# EAGLE board CFT-PB2-smd-revB-old (EAGLE 5.11), part 1 of 2
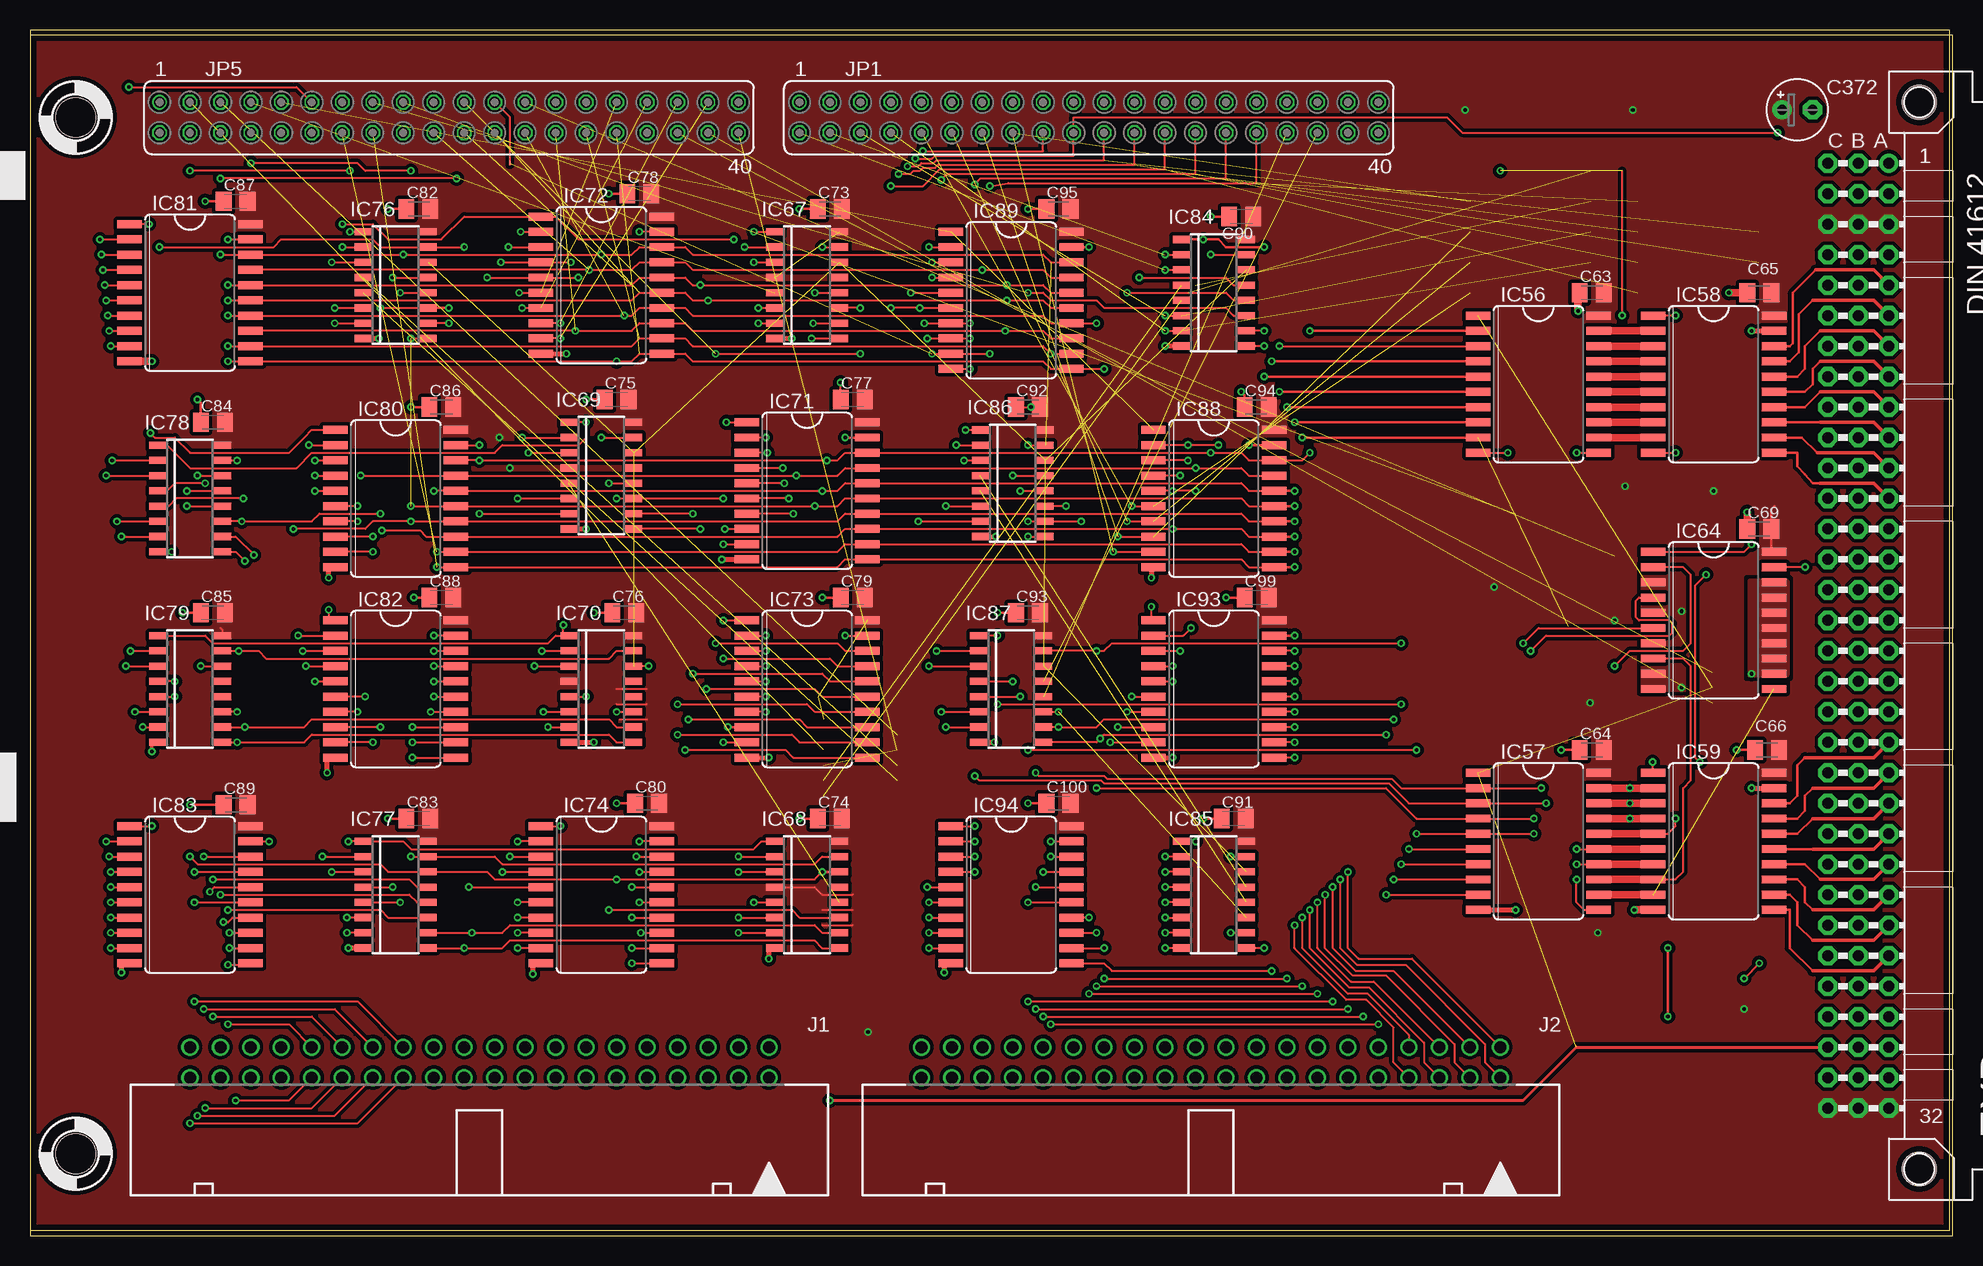
[diagram p6: board, top side]
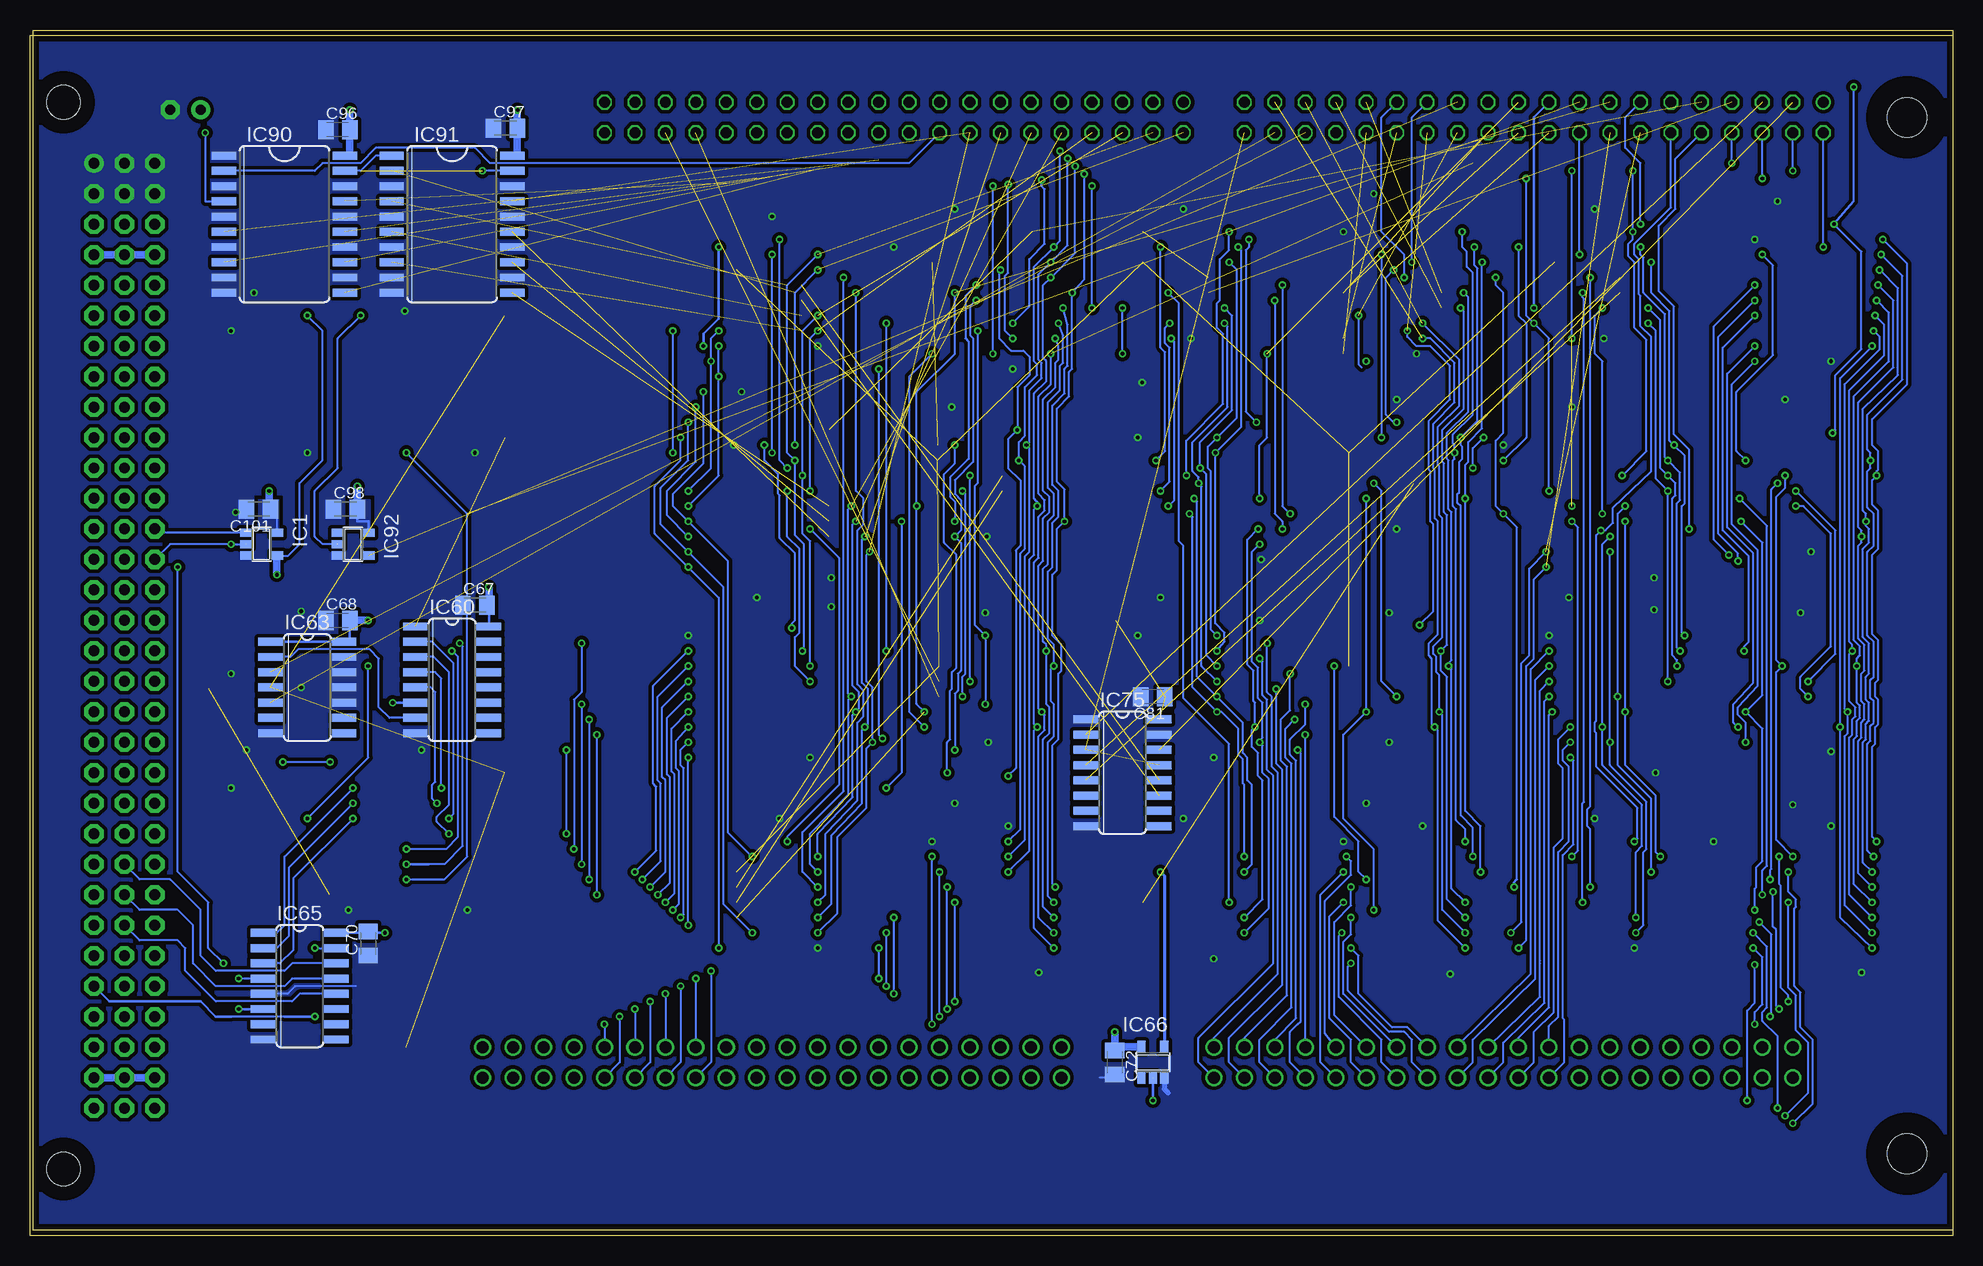
[diagram p7: board, bottom side, seen from below]

Size 160 x 100 mm. Coordinates in mm from the lower left corner, seen from the top.
Outline: 0,0 160,0 160,100 0,100 0,0
Copper layers (1*16): Top 0.035mm / dielectric 0.2mm / Bottom 0.035mm
Design rules "MyroPCB-6mil-prototyping": minimum track width 6mil, minimum drill 12mil, track to track 6mil, track to pad 6mil, pad to pad 6mil, via to via 6mil, smd to smd 6mil, copper to edge 20mil, drill to drill 8mil, minimum pad ring 6mil, minimum via ring 6mil, stop-mask expansion 4mil, vias tented up to drill 0mil, thermal gap 6mil
Net classes: 0 default: width 0.152 mm, clearance 0.152 mm; 1 low power: width 0.305 mm, clearance 0.152 mm; 2 LED power: width 0.406 mm, clearance 0.254 mm

## Footprints (pad centres in the part's own frame; a part is rotated, then mirrored left to right if it is on the bottom)
C0805K = smd 1.3 x 1.6: 1 -1,0; 2 1,0
E2,5-5 = drill 0.813 pad 1.6 round: + -1.27,0 | drill 0.813 pad 1.6 octagon: - 1.27,0
VG96K = drill 0.914 pad 1.6 round: A1 154.94,39.37 | drill 0.914 pad 1.6 octagon: A2 154.94,36.83; A3 154.94,34.29; A4 154.94,31.75; A5 154.94,29.21; A6 154.94,26.67; A7 154.94,24.13; A8 154.94,21.59; A9 154.94,19.05; A10 154.94,16.51; A11 154.94,13.97; A12 154.94,11.43; A13 154.94,8.89; A14 154.94,6.35; A15 154.94,3.81; A16 154.94,1.27; A17 154.94,-1.27; A18 154.94,-3.81; A19 154.94,-6.35; A20 154.94,-8.89; A21 154.94,-11.43; A22 154.94,-13.97; A23 154.94,-16.51; A24 154.94,-19.05; A25 154.94,-21.59; A26 154.94,-24.13; A27 154.94,-26.67; A28 154.94,-29.21; A29 154.94,-31.75; A30 154.94,-34.29; A31 154.94,-36.83; A32 154.94,-39.37; B1 152.4,39.37; B2 152.4,36.83; B3 152.4,34.29; B4 152.4,31.75; B5 152.4,29.21; B6 152.4,26.67; B7 152.4,24.13; B8 152.4,21.59; B9 152.4,19.05; B10 152.4,16.51; B11 152.4,13.97; B12 152.4,11.43; B13 152.4,8.89; B14 152.4,6.35; B15 152.4,3.81; B16 152.4,1.27; B17 152.4,-1.27; B18 152.4,-3.81; B19 152.4,-6.35; B20 152.4,-8.89; B21 152.4,-11.43; B22 152.4,-13.97; B23 152.4,-16.51; B24 152.4,-19.05; B25 152.4,-21.59; B26 152.4,-24.13; B27 152.4,-26.67; B28 152.4,-29.21; B29 152.4,-31.75; B30 152.4,-34.29; B31 152.4,-36.83; B32 152.4,-39.37; C1 149.86,39.37; C2 149.86,36.83; C3 149.86,34.29; C4 149.86,31.75; C5 149.86,29.21; C6 149.86,26.67; C7 149.86,24.13; C8 149.86,21.59; C9 149.86,19.05; C10 149.86,16.51; C11 149.86,13.97; C12 149.86,11.43; C13 149.86,8.89; C14 149.86,6.35; C15 149.86,3.81; C16 149.86,1.27; C17 149.86,-1.27; C18 149.86,-3.81; C19 149.86,-6.35; C20 149.86,-8.89; C21 149.86,-11.43; C22 149.86,-13.97; C23 149.86,-16.51; C24 149.86,-19.05; C25 149.86,-21.59; C26 149.86,-24.13; C27 149.86,-26.67; C28 149.86,-29.21; C29 149.86,-31.75; C30 149.86,-34.29; C31 149.86,-36.83; C32 149.86,-39.37 | hole 2.794: 157.48,44.45; 157.48,-44.45
STANDOFF_28_60 = hole 3.302: 0,0
SOT23-5 = smd 0.69 x 0.99: 1 -0.95,-1.29; 2 0,-1.29; 3 0.95,-1.29; 4 0.95,1.3; 5 -0.95,1.3
SO20W = smd 0.66 x 2.032: 1 -5.715,-5.029; 2 -4.445,-5.029; 3 -3.175,-5.029; 4 -1.905,-5.029; 5 -0.635,-5.029; 6 0.635,-5.029; 7 1.905,-5.029; 8 3.175,-5.029; 9 4.445,-5.029; 10 5.715,-5.029; 11 5.715,5.029; 12 4.445,5.029; 13 3.175,5.029; 14 1.905,5.029; 15 0.635,5.029; 16 -0.635,5.029; 17 -1.905,5.029; 18 -3.175,5.029; 19 -4.445,5.029; 20 -5.715,5.029
SO16 = smd 0.66 x 2.032: 1 -4.445,-3.073; 2 -3.175,-3.073; 3 -1.905,-3.073; 4 -0.635,-3.073; 5 0.635,-3.073; 6 1.905,-3.073; 7 3.175,-3.073; 8 4.445,-3.073; 9 4.445,3.073; 10 3.175,3.073; 11 1.905,3.073; 12 0.635,3.073; 13 -0.635,3.073; 14 -1.905,3.073; 15 -3.175,3.073; 16 -4.445,3.073
SO14 = smd 0.66 x 2.032: 1 -3.81,-3.073; 2 -2.54,-3.073; 3 -1.27,-3.073; 4 0,-3.073; 5 1.27,-3.073; 6 2.54,-3.073; 7 3.81,-3.073; 8 3.81,3.073; 9 2.54,3.073; 10 1.27,3.073; 11 0,3.073; 12 -1.27,3.073; 13 -2.54,3.073; 14 -3.81,3.073
SO16D = smd 0.6 x 1.4: 1 -4.445,-2.715; 2 -3.175,-2.715; 3 -1.905,-2.715; 4 -0.635,-2.715; 5 0.635,-2.715; 6 1.905,-2.715; 7 3.175,-2.715; 8 4.445,-2.715; 9 4.445,2.715; 10 3.175,2.715; 11 1.905,2.715; 12 0.635,2.715; 13 -0.635,2.715; 14 -1.905,2.715; 15 -3.175,2.715; 16 -4.445,2.715
PAK100/2500-5-40 = drill 1 pad 1.422 round: 1 -24.13,-1.27; 2 -24.13,1.27; 3 -21.59,-1.27; 4 -21.59,1.27; 5 -19.05,-1.27; 6 -19.05,1.27; 7 -16.51,-1.27; 8 -16.51,1.27; 9 -13.97,-1.27; 10 -13.97,1.27; 11 -11.43,-1.27; 12 -11.43,1.27; 13 -8.89,-1.27; 14 -8.89,1.27; 15 -6.35,-1.27; 16 -6.35,1.27; 17 -3.81,-1.27; 18 -3.81,1.27; 19 -1.27,-1.27; 20 -1.27,1.27; 21 1.27,-1.27; 22 1.27,1.27; 23 3.81,-1.27; 24 3.81,1.27; 25 6.35,-1.27; 26 6.35,1.27; 27 8.89,-1.27; 28 8.89,1.27; 29 11.43,-1.27; 30 11.43,1.27; 31 13.97,-1.27; 32 13.97,1.27; 33 16.51,-1.27; 34 16.51,1.27; 35 19.05,-1.27; 36 19.05,1.27; 37 21.59,-1.27; 38 21.59,1.27; 39 24.13,-1.27; 40 24.13,1.27
FE20-2 = drill 0.914 round: 1 -24.13,1.27 | drill 0.914 octagon: 2 -24.13,-1.27; 3 -21.59,1.27; 4 -21.59,-1.27; 5 -19.05,1.27; 6 -19.05,-1.27; 7 -16.51,1.27; 8 -16.51,-1.27; 9 -13.97,1.27; 10 -13.97,-1.27; 11 -11.43,1.27; 12 -11.43,-1.27; 13 -8.89,1.27; 14 -8.89,-1.27; 15 -6.35,1.27; 16 -6.35,-1.27; 17 -3.81,1.27; 18 -3.81,-1.27; 19 -1.27,1.27; 20 -1.27,-1.27; 21 1.27,1.27; 22 1.27,-1.27; 23 3.81,1.27; 24 3.81,-1.27; 25 6.35,1.27; 26 6.35,-1.27; 27 8.89,1.27; 28 8.89,-1.27; 29 11.43,1.27; 30 11.43,-1.27; 31 13.97,1.27; 32 13.97,-1.27; 33 16.51,1.27; 34 16.51,-1.27; 35 19.05,1.27; 36 19.05,-1.27; 37 21.59,1.27; 38 21.59,-1.27; 39 24.13,1.27; 40 24.13,-1.27
SIGNAL-RENAME = smd 0.305 x 0.152: P$1 0,0; P$2 0,0

## Placement (x,y rotation side)
C63  0.1uF  [C0805K]  130.18,78.11 0 top
C64  0.1uF  [C0805K]  130.18,40.01 0 top
C65  0.1uF  [C0805K]  144.15,78.11 0 top
C66  0.1uF  [C0805K]  144.78,40.01 0 top
C67  0.1uF  [C0805K]  123.19,52.07 0 bottom
C68  0.1uF  [C0805K]  134.62,50.8 0 bottom
C69  0.1uF  [C0805K]  144.15,58.42 0 top
C70  0.1uF  [C0805K]  132.08,23.88 90 bottom
C72  1uF  [C0805K]  69.85,13.97 270 bottom
C73  0.1uF  [C0805K]  66.67,85.09 0 top
C74  0.1uF  [C0805K]  66.67,34.29 0 top
C75  0.1uF  [C0805K]  48.9,69.22 0 top
C76  0.1uF  [C0805K]  49.53,51.44 0 top
C77  0.1uF  [C0805K]  68.58,69.22 0 top
C78  0.1uF  [C0805K]  50.8,86.36 0 top
C79  0.1uF  [C0805K]  68.58,52.7 0 top
C80  0.1uF  [C0805K]  51.44,35.56 0 top
C81  1uF  [C0805K]  66.67,44.45 180 bottom
C82  0.1uF  [C0805K]  32.38,85.09 0 top
C83  0.1uF  [C0805K]  32.38,34.29 0 top
C84  0.1uF  [C0805K]  15.24,67.31 0 top
C85  0.1uF  [C0805K]  15.24,51.44 0 top
C86  0.1uF  [C0805K]  34.29,68.58 0 top
C87  0.1uF  [C0805K]  17.14,85.72 0 top
C88  0.1uF  [C0805K]  34.29,52.7 0 top
C89  0.1uF  [C0805K]  17.14,35.43 0 top
C90  1uF  [C0805K]  100.97,84.45 180 top
C91  0.1uF  [C0805K]  100.33,34.29 0 top
C92  0.1uF  [C0805K]  83.19,68.58 0 top
C93  0.1uF  [C0805K]  83.19,51.44 0 top
C94  0.1uF  [C0805K]  102.23,68.58 0 top
C95  0.1uF  [C0805K]  85.72,85.09 0 top
C96  0.1uF  [C0805K]  134.62,91.69 0 bottom
C97  0.1uF  [C0805K]  120.65,91.82 0 bottom
C98  0.1uF  [C0805K]  133.99,60.07 0 bottom
C99  0.1uF  [C0805K]  102.23,52.7 0 top
C100  0.1uF  [C0805K]  85.72,35.56 0 top
C101  1uF  [C0805K]  141.22,60.07 180 bottom
C372  1uF  [E2,5-5]  147.32,93.34 0 top
EXP  [VG96K]  0,49.53 0 top
H1  HOLE  [STANDOFF_28_60]  22.23,-13.97 0 top  (outside the outline)
H2  HOLE  [STANDOFF_28_60]  15.88,-13.97 0 top  (outside the outline)
H3  HOLE  [STANDOFF_28_60]  3.81,6.35 0 top
H4  HOLE  [STANDOFF_28_60]  3.81,92.71 0 top
IC1  74AHC1G08DBV  [SOT23-5]  140.97,57.15 270 bottom
IC56  74HC574D  [SO20W]  125.73,70.48 270 top
IC57  74HC574D  [SO20W]  125.73,32.38 270 top
IC58  74HC541DW  [SO20W]  140.34,70.48 270 top
IC59  74HC541DW  [SO20W]  140.34,32.38 270 top
IC60  74HC138D  [SO16]  125.09,45.85 270 bottom
IC63  74HC74D  [SO14]  137.16,45.21 270 bottom
IC64  74HC688DW  [SO20W]  140.34,50.8 270 top
IC65  74HC138D  [SO16]  137.79,20.32 270 bottom
IC66  74AHC1G04DBV  [SOT23-5]  66.67,13.97 0 bottom
IC67  74HC193D  [SO16D]  64.77,78.74 270 top
IC68  74HC193D  [SO16D]  64.77,27.94 270 top
IC69  74HC193D  [SO16D]  47.62,62.87 270 top
IC70  74HC193D  [SO16D]  47.62,45.09 270 top
IC71  74HC541DW  [SO20W]  64.77,61.59 270 top
IC72  74HC541DW  [SO20W]  47.62,78.74 270 top
IC73  74HC541DW  [SO20W]  64.77,45.09 270 top
IC74  74HC541DW  [SO20W]  47.62,27.94 270 top
IC75  74HC139D  [SO16]  69.22,38.1 270 bottom
IC76  74HC193D  [SO16D]  30.48,78.74 270 top
IC77  74HC193D  [SO16D]  30.48,27.94 270 top
IC78  74HC193D  [SO16D]  13.34,60.96 270 top
IC79  74HC193D  [SO16D]  13.34,45.09 270 top
IC80  74HC541DW  [SO20W]  30.48,60.96 270 top
IC81  74HC541DW  [SO20W]  13.34,78.11 270 top
IC82  74HC541DW  [SO20W]  30.48,45.09 270 top
IC83  74HC541DW  [SO20W]  13.34,27.94 270 top
IC84  74HC193D  [SO16D]  98.68,78.11 270 top
IC85  74HC193D  [SO16D]  98.68,27.94 270 top
IC86  74HC193D  [SO16D]  81.92,62.23 270 top
IC87  74HC193D  [SO16D]  81.79,45.09 270 top
IC88  74HC541DW  [SO20W]  98.68,60.96 270 top
IC89  74HC541DW  [SO20W]  81.79,77.47 270 top
IC90  74HC688DW  [SO20W]  139.06,83.82 270 bottom
IC91  74HC688DW  [SO20W]  125.09,83.82 270 bottom
IC92  74AHC1G04DBV  [SOT23-5]  133.35,57.15 270 bottom
IC93  74HC541DW  [SO20W]  98.68,45.09 270 top
IC94  74HC541DW  [SO20W]  81.79,27.94 270 top
J1  2540-5  [PAK100/2500-5-40]  37.47,13.97 180 top
J2  2540-5  [PAK100/2500-5-40]  98.42,13.97 180 top
JP1  [FE20-2]  88.27,92.71 0 top
JP5  [FE20-2]  34.92,92.71 0 top
X1  SIGNAL-RENAME  [SIGNAL-RENAME]  40.01,88.9 90 top